# Altium project PCB_Project.PrjPcb
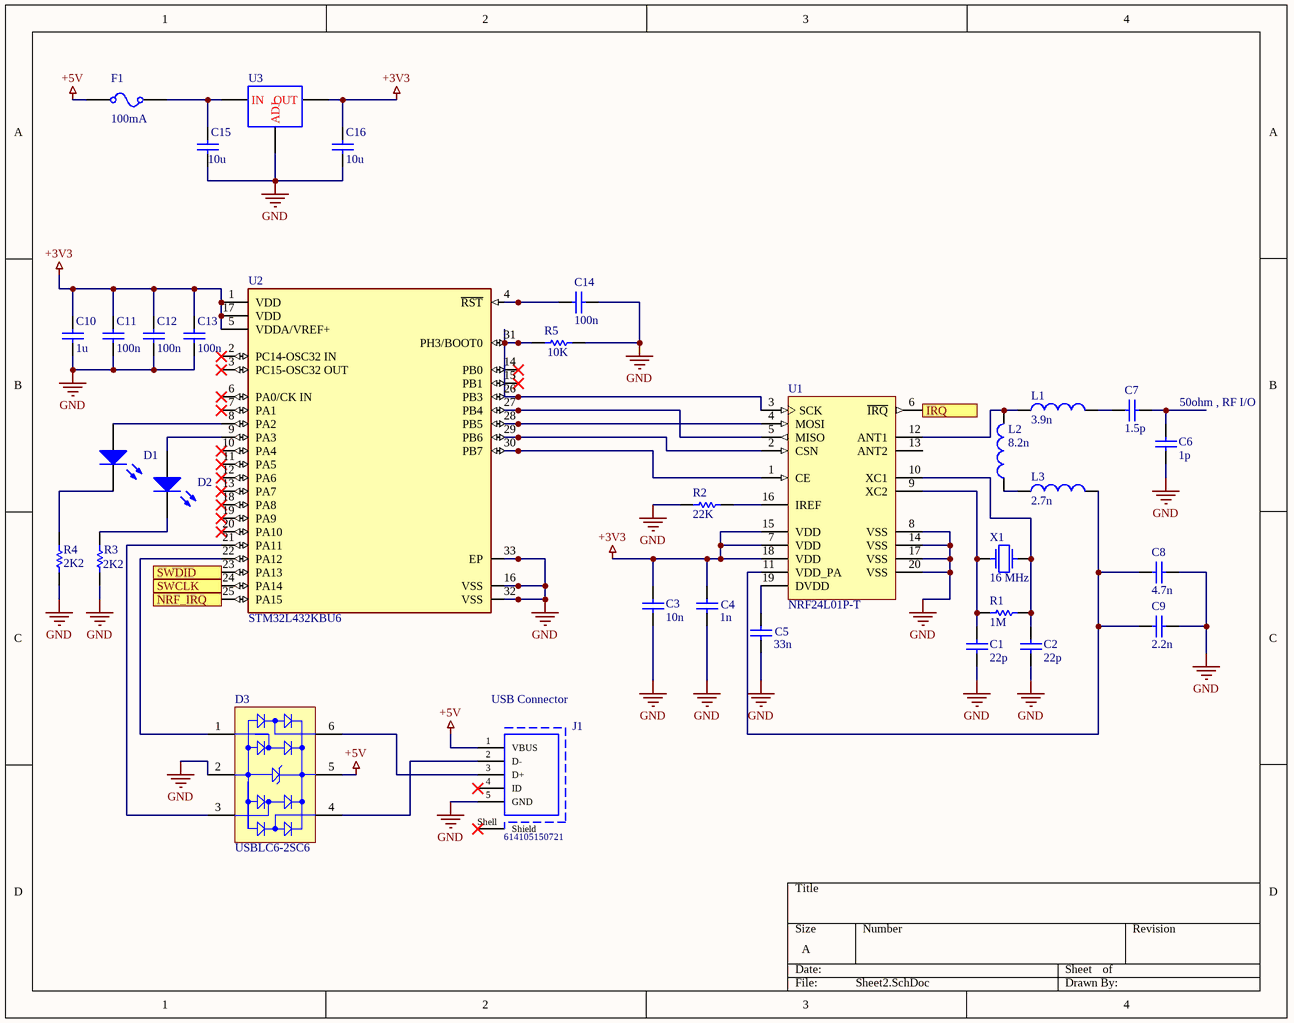
[diagram p0: Sheet2.SchDoc]
1 sheet, 33 parts. Net scope: flat (ports and power ports of the same name join across sheets).

## Sheet Sheet2.SchDoc
size A; SheetNumber: 1; SheetTotal: 1

### Parts
C1  value 22p  (hidden comment: Capacitor)
C2  value 22p  (hidden comment: Capacitor)
C3  value 10n  (hidden comment: Capacitor)
C4  value 1n  (hidden comment: Capacitor)
C5  value 33n  (hidden comment: Capacitor)
C6  value 1p  (hidden comment: Capacitor)
C7  value 1.5p  (hidden comment: Capacitor)
C8  value 4.7n  (hidden comment: Capacitor)
C9  value 2.2n  (hidden comment: Capacitor)
C10  value 1u  (hidden comment: Capacitor)
C11  value 100n  (hidden comment: Capacitor)
C12  value 100n  (hidden comment: Capacitor)
C13  value 100n  (hidden comment: Capacitor)
C14  value 100n  (hidden comment: Capacitor)
C15  value 10u  (hidden comment: Capacitor)
C16  value 10u  (hidden comment: Capacitor)
D1  Light-Emitting Diode  (value not drawn)
D2  Light-Emitting Diode  (value not drawn)
D3  USBLC6-2SC6  [STM-SOT23-6L_V]
F1  CURRENT: 100mA  (hidden comment: Fuse)
J1  614105150721  [614105150721]
L1  value 3.9n  (hidden comment: Inductor)
L2  value 8.2n  (hidden comment: Inductor)
L3  value 2.7n  (hidden comment: Inductor)
R1  value 1M  (hidden comment: Resistor)
R2  value 22K  (hidden comment: Resistor)
R3  value 2K2  (hidden comment: Resistor)
R4  value 2K2  (hidden comment: Resistor)
R5  value 10K  (hidden comment: Resistor)
U1  NRF24L01P-T  [NRSC-QFN-20_L]
U2  STM32L432KBU6  [FP-UFQFPN32-A0B8-MFG]
U3  Positive Adjustable Voltage Regulator  (value not drawn)
X1  F0: 16 MHz  (hidden comment: Crystal)

### Ports
IRQ, NRF_IRQ, SWCLK, SWDID

### Nets
+3V3: C3.2 C4.2 C10.2 C11.2 C12.2 C13.2 C16.2 U1.7(VDD) U1.15(VDD) U1.18(VDD) U2.1(VDD) U2.5(VDDA/VREF+) U2.17(VDD) U3.3(OUT)
+5V: D3.5(VBUS) F1.1 J1.1(VBUS)
GND: C1.1 C2.1 C3.1 C4.1 C5.1 C6.1 C8.2 C9.2 C10.1 C11.1 C12.1 C13.1 C14.2 C15.1 C16.1 D3.2(GND) J1.5(GND) R2.1 R3.1 R4.1 R5.1 U1.8(VSS) U1.14(VSS) U1.17(VSS) U1.20(VSS) U2.16(VSS) U2.32(VSS) U2.33(EP) U3.2(ADJ)
NetC1_2: C1.2 R1.1 U1.9(XC2) X1.1
NetC2_2: C2.2 R1.2 U1.10(XC1) X1.2
NetC5_2: C5.2 U1.19(DVDD)
NetC6_2: C6.2 C7.2
NetC7_1: C7.1 L1.2
NetC8_1: C8.1 C9.1 L3.2 U1.11(VDD_PA)
NetC14_1: C14.1 U2.4(~{RST})
NetC15_2: C15.2 F1.2 U3.1(IN)
NetD1_1: D1.1(A) U2.8(PA2)
NetD1_2: D1.2(K) R4.2
NetD2_1: D2.1(A) U2.9(PA3)
NetD2_2: D2.2(K) R3.2
NetD3_1: D3.1(I/O_1) U2.22(PA12)
NetD3_3: D3.3(I/O_2) U2.21(PA11)
NetD3_4: D3.4(I/O_3) J1.2(D-)
NetD3_6: D3.6(I/O_4) J1.3(D+)
NetL1_1: L1.1 L2.2 U1.12(ANT1)
NetL2_1: L2.1 L3.1
NetR2_2: R2.2 U1.16(IREF)
NetR5_2: R5.2 U1.3(SCK) U2.26(PB3) U2.31(PH3/BOOT0)
NetU1_1: U1.1(CE) U2.30(PB7)
NetU1_2: U1.2(CSN) U2.29(PB6)
NetU1_4: U1.4(MOSI) U2.28(PB5)
NetU1_5: U1.5(MISO) U2.27(PB4)
NetU1_6: U1.6(~{IRQ}) ; port IRQ
NetU2_23: U2.23(PA13) ; port SWDID
NetU2_24: U2.24(PA14) ; port SWCLK
NetU2_25: U2.25(PA15) ; port NRF_IRQ

Not connected (* = marked no-connect by the designer): J1 4(ID)* Shell(Shield)*; U1 13(ANT2); U2 2(PC14-OSC32_IN)* 3(PC15-OSC32_OUT)* 6(PA0/CK_IN)* 7(PA1)* 10(PA4)* 11(PA5)* 12(PA6)* 13(PA7)* 14(PB0)* 15(PB1)* 18(PA8)* 19(PA9)* 20(PA10)*

### Notes on the sheet
- 50ohm , RF I/O
- (near J1) USB Connector

### Library data of the parts
C1-C16 = Capacitor: SimulationGenericComponent: True
D1 D2 = LED: AF: 1; BV: 0; BV_MAX: 1e99; EG: 1.11; FC: 0.5; IBV: 0.001; IS: 1e-14; MJSW: 0.33; NTUN: 30; TNOM: 27; XTI: 3; SimulationGenericComponent: True; CJO: 0; CJP: 0; CTA: 0; CTP: 0; FCS: 0.5; FV_MAX: 1e99; IKF: 0; IKR: 0; ISR: 1e-14; JSW: 0; JTUN: 0; JTUNSW: 0; KEG: 1; KF: 0; LEVEL: 1; N: 1; NBV: 1; NR: 1; NS: 1; PHP: 1; RS: 0; TCV: 0; TLEV: 0; TLEVC: 0; TM1: 0; TM2: 0; TPB: 0; TPHP: 0; TRS: 0; TRS2: 0; TT: 0; TTT1: 0; TTT2: 0; VJ: 1; XTITUN: 3
D3 = CMP-2000-05378-1: Very low capacitance ESD protection, 3.5 pF, -40 to 125 degC, 6-Pin SOT23, RoHS, Tape and Reel; Manufacturer: STMicroelectronics; Polarity: Uni-Directional; Clamping Voltage: 17V; Rad Hardened: No; Product Height (mm): 1.3mm; Leakage Current (Max): 0.15uA; Product Length (mm): 3.05mm; Number of Elements: 1; Peak Pulse Current: 5A; Configuration: Dual; Reverse Breakdown Voltage: 6V; Working Voltage (Max): 5V; Capacitance Value: 3.5pF; Suppressor Type: DiodeArrays; Product Depth (mm): 1.75mm; Test Current (It): 1mA; Package / Case: SOT-23; Operating Temperature Max Deg. C: 125C; Package Description: 6-Pin Small Outline Transistor, Body 2.925 x 1.625 mm, Pitch 0.95 mm; Package Reference: SOT23-6L; Datasheet Version: Rev. 5, 10/2011; Operating Temperature Min Deg. C: -40C; Mounting Style: SurfaceMount; Direction Type: Uni-Directional; Mounting: SurfaceMount; Pin Count: 6; Leakage Current: 0.15uA; Packaging: TapeandReel; Operating Temperature Classification: Automotive; Clamping Voltage (Max): 17V; Manufacturer URL: http://www.st.com/; Reverse Stand-off Voltage: 5V; Datasheet URL: http://www.st.com/st-web-ui/static/active/en/resource/technical/document/datasheet/CD00050750.pdf; Working Voltage: 5V; Operating Temp Range: -40Cto125C
F1 = Fuse: RESISTANCE: 1m; SimulationGenericComponent: True
J1 = CMP-1502-03250-1: Micro USB 2.0 Type B Receptacle WR-COM, Vertical, THT; Manufacturer: Wurth Elektronik; Working Voltage: 30VAC; Contact Resistance: 30mOhm; Rated Current: 1.8A; Orientation: Vertical; Package Reference: 614105150721; Operating Temperature: -40to85degC; Publisher: WurthElektronik; Part Number: 614105150721; Mounting Technology: THT; Manufacturer URL: http://www.we-online.de; Connector Type: MicroUSB2.0TypeB; Packaging: TapeandReel; Gender: Receptacle; Datasheet URL: https://katalog.we-online.de/em/datasheet/614105150721.pdf
L1-L3 = Inductor: SimulationGenericComponent: True
R1-R5 = Resistor: TC1: 0; SimulationGenericComponent: True; TC2: 0
U1 = CMP-2000-06859-1: Single Chip Transceiver, 2.4 GHz, 60 mW, 1.9 to 3.6 V, -40 to 85 degC, 20-Pin QFN, RoHS, Tray; Manufacturer: Nordic Semiconductor; Data Rate (Max): 2Mbps; Current - Transmitting: 7mA~11.3mA; Power - Output: 0dBm; Other Names: 1490-1019; Online Catalog: nRF24L01+; Current - Receiving: 12.6mA~13.5mA; For Use With: 1490-1002-ND-KITEVALUATIONNRF24L01P1568-1295-ND-SPARKFUNTRANSCEIVERBREAKOUT-1568-1296-ND-SPARKFUNTRANSCEIVERBREAKOUT-1471-1410-ND-DEVBOARDNRFSCLICKNRF24L01P-MODULE-PCB-ND-KITEVALNRF24L01+PCBANTENNANRF24L01P-MODULE-SMA-ND-KITEVALNRF24L01+SMACONNNRF24L01P-UPGRADE-ND-UPGRADE2PCB/1SMANRF24L01103990038-ND-DEVDUINOSENSORNODEV1.3103990053-ND-DEVDUINOSENSORNODEV2(ATMEGA103990074-ND-DEVDUINOSENSORNODE106990026-ND-ENERGYMONITORSHIELDV2113990088-ND-WIRELESSGATESHIELD113990095-ND-DEVDUINOSENSORNODEV3(ATMEGA106030001-ND-ENERGYMONITORSHIELD1597-1361-ND-DEVDUINOSENSORNODEV2.2(ATMEG105990030-ND-RGBWSTRIPWIRELESSSHIELDV1.0; Frequency: 2.4GHz; Design Resources: DevelopmentToolSelector; RF Family/Standard: GeneralISM>1GHZ; Serial Interfaces: SPI; Sensitivity: -94dBm; Voltage - Supply: 1.9V~3.6V; Modulation: GFSK; GPIO: -; Package Reference: QFN20; Memory Size: -; Category: RF/IFandRFID; Type: TxRxOnly; Standard Package: 490; Package / Case: 20-VFQFNExposedPad; Packaging: Tray; Series: -; Package Description: 20-Pin Quad Flat No-lead Package, Body 4 x 4 mm, Pitch 0.5 mm; Datasheet Version: Rev. 1.0, 09/2008; Protocol: -; Manufacturer URL: http://www.nordicsemi.com/eng/Products/; Operating Temperature: -40°C~85°C; Family: RFTransceiverICs; Datasheet URL: http://www.nordicsemi.com/eng/content/download/2726/34069/file/nRF24L01P_Product_Specification_1_0.pdf; Mounting Technology: SurfaceMount
U2 = CMP-12105-000014-1: IC MCU 32BIT 128KB FLASH 32QFPN; Manufacturer: STMicroelectronics; Memory Size: 128KBytes; Number Of I/Os: 26; Max Supply Voltage: 3.6V; Core Architecture: ARM Cortex-M4; Number Of A/D Converters: 1; Number Of Timers/Counters: 8; Min Supply Voltage: 1.62V; Interface: I2C,SPI,UART,USART,USB,IrDA; Number Of Spi Channels: 2; Frequency: 80MHz; Max Junction Temp: +105°C; Number Of Adc Channels: 10; Ram Size: 64KBytes; Data Bus Width: 32bits; Ambient Temperature Range High: +85°C; Device Class L2: Embedded Processors and Controllers; Temperature: -40°C to +85°C; Category: IC; ComponentLink2URL: https://www.st.com/resource/en/datasheet/stm32l432kb.pdf; Device Class L1: Integrated Circuits (ICs); ComponentLink2Description: Datasheet; Memory Type: FLASH; Ipc Land Pattern Name: QFN50P500X500X55-32; Temperature Range Low: -40°C; Height: 0.6mm; Digikey Description: IC MCU 32BIT 128KB FLASH 32QFPN; Temperature Range High: +85°C; Device Class L3: Microcontrollers; Lead Free: Yes; RoHS: TRUE; Octopart: https://octopart.com/stm32l432kbu6-stmicroelectronics-74568735; Manufacturer Part Number: STM32L432KBU6; Number Of Uart Channels: 1; Ambient Temperature Range Low: -40°C; Package: UFQFPN32-A0B8; Number Of I2C Channels: 2; Number Of Cores: 1; Automotive: No
U3 = Linear Voltage Regulator (Adjustable): SimulationGenericComponent: True
X1 = Crystal: R: 500; Q: 50K; SimulationGenericComponent: True